# EAGLE design Nanocopter_V2 (EAGLE 6.5.0)
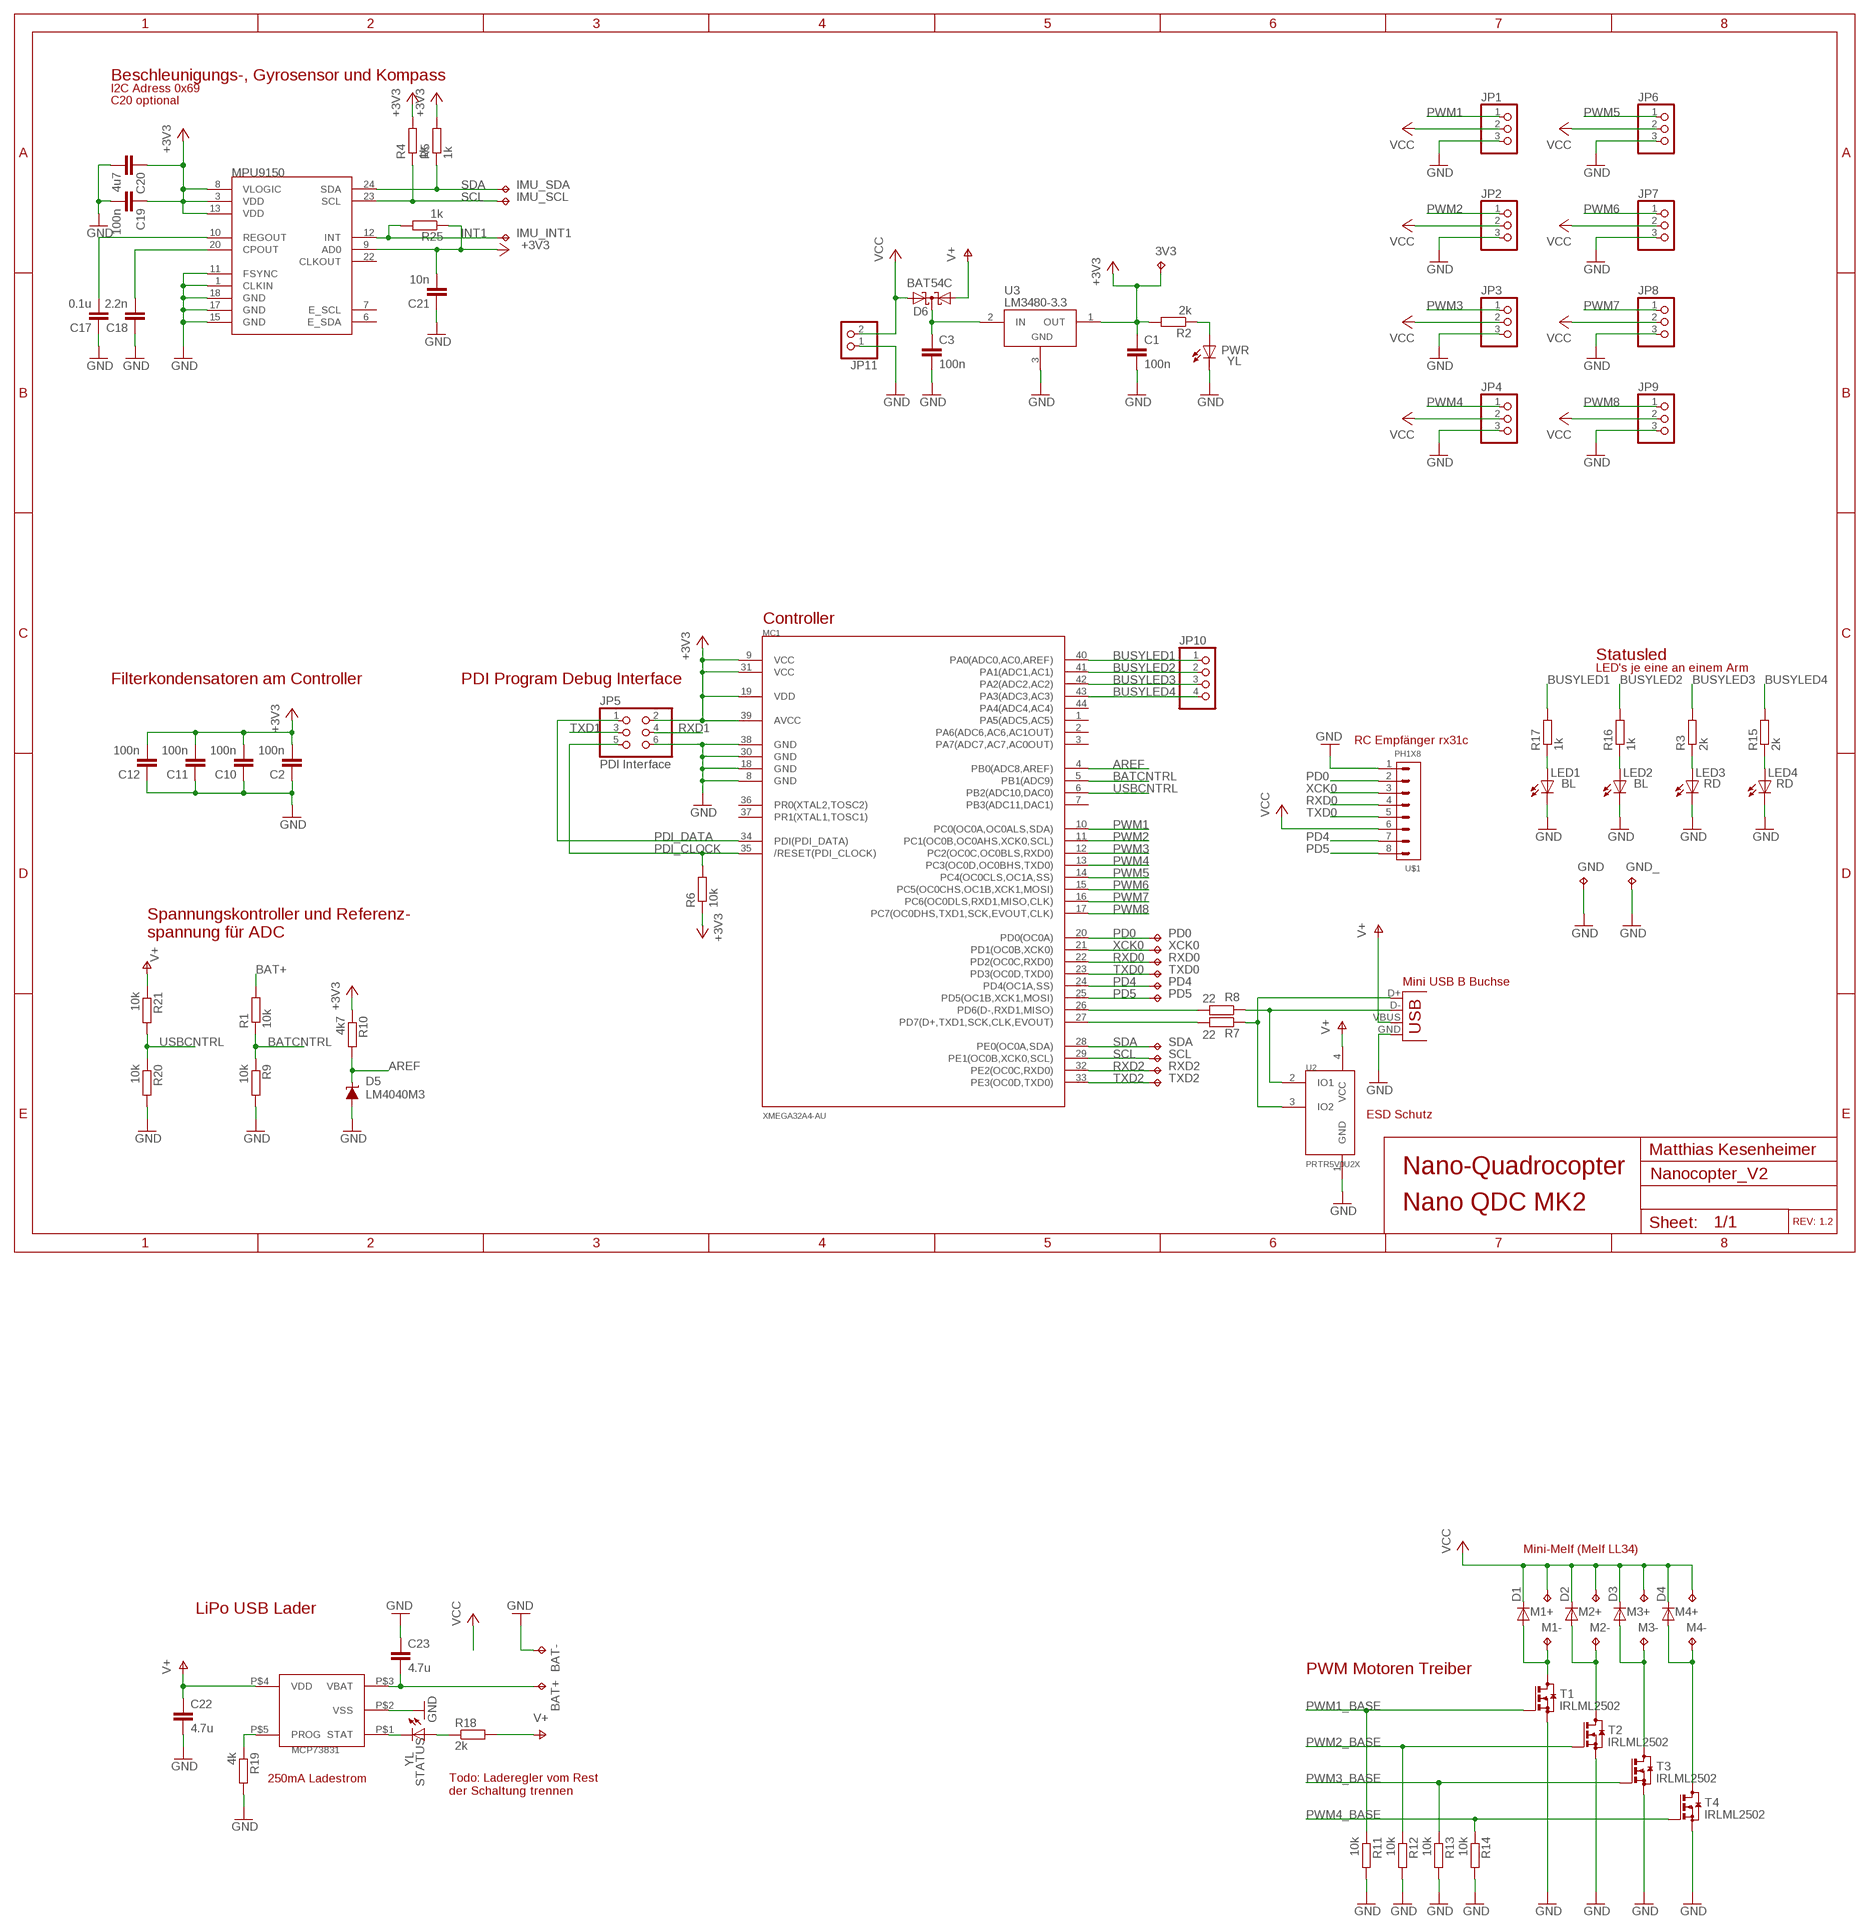
[diagram p0: schematic, sheet 1]

## Parts
3V3  TPTP12SQ  [TP12SQ]
BAT+  TPTP12SQ  [TP12SQ]
BAT-  TPTP12SQ  [TP12SQ]
C1  100n  C-EUC0603  [C0603]
C2  100n  C-EUC0603  [C0603]
C3  100n  C-EUC0603  [C0603]
C10  100n  C-EUC0603  [C0603]
C11  100n  C-EUC0603  [C0603]
C12  100n  C-EUC0603  [C0603]
C17  0.1u  C-EUC0603  [C0603]
C18  2.2n  C-EUC0603  [C0603]
C19  100n  C-EUC0603  [C0603]
C20  4u7  C-EUC0603  [C0603]
C21  10n  C-EUC0603  [C0603]
C22  4.7u  C-EUC1206  [C1206]
C23  4.7u  C-EUC1206  [C1206]
D1  DIODE-MINIMELF  [MINIMELF]
D2  DIODE-MINIMELF  [MINIMELF]
D3  DIODE-MINIMELF  [MINIMELF]
D4  DIODE-MINIMELF  [MINIMELF]
D5  LM4040M3  [SOT-23]
D6  BAT54C  [SOT23]
GND  TPTP12SQ  [TP12SQ]
GND_  TPTP12SQ  [TP12SQ]
IMU_INT1  TPTP10SQ  [TP10SQ]
IMU_SCL  TPTP10SQ  [TP10SQ]
IMU_SDA  TPTP10SQ  [TP10SQ]
JP1  PINHD-1X3  [1X03]
JP2  PINHD-1X3  [1X03]
JP3  PINHD-1X3  [1X03]
JP4  PINHD-1X3  [1X03]
JP5  PDI Interface  PINHD-2X3  [2X03]
JP6  PINHD-1X3  [1X03]
JP7  PINHD-1X3  [1X03]
JP8  PINHD-1X3  [1X03]
JP9  PINHD-1X3  [1X03]
JP10  PINHD-1X4  [1X04]
JP11  PINHD-1X2  [1X02]
LED1  BL  LEDCHIPLED_0603  [CHIPLED_0603]
LED2  BL  LEDCHIPLED_0603  [CHIPLED_0603]
LED3  RD  LEDCHIPLED_0603  [CHIPLED_0603]
LED4  RD  LEDCHIPLED_0603  [CHIPLED_0603]
M1+  TPTP15SQ  [TP15SQ]
M1-  TPTP15SQ  [TP15SQ]
M2+  TPTP15SQ  [TP15SQ]
M2-  TPTP15SQ  [TP15SQ]
M3+  TPTP15SQ  [TP15SQ]
M3-  TPTP15SQ  [TP15SQ]
M4+  TPTP15SQ  [TP15SQ]
M4-  TPTP15SQ  [TP15SQ]
MC1  XMEGA32A4-AU  [TQFP44]
MCP73831  MCP73831  [5PIN_SOT23]
MPU9150  MPU-9150QFN-24-NP  [QFN-24-NP]
PD0  TPTP10SQ  [TP10SQ]
PD4  TPTP10SQ  [TP10SQ]
PD5  TPTP10SQ  [TP10SQ]
PWR  YL  LEDCHIPLED_0603  [CHIPLED_0603]
R1  10k  R-EU_R0603  [R0603]
R2  2k  R-EU_R0603  [R0603]
R3  2k  R-EU_R0603  [R0603]
R4  1k  R-EU_R0603  [R0603]
R5  1k  R-EU_R0603  [R0603]
R6  10k  R-EU_R0603  [R0603]
R7  22  R-EU_R0603  [R0603]
R8  22  R-EU_R0603  [R0603]
R9  10k  R-EU_R0603  [R0603]
R10  4k7  R-EU_R0603  [R0603]
R11  10k  R-EU_R0603  [R0603]
R12  10k  R-EU_R0603  [R0603]
R13  10k  R-EU_R0603  [R0603]
R14  10k  R-EU_R0603  [R0603]
R15  2k  R-EU_R0603  [R0603]
R16  1k  R-EU_R0603  [R0603]
R17  1k  R-EU_R0603  [R0603]
R18  2k  R-EU_R0603  [R0603]
R19  4k  R-EU_R0603  [R0603]
R20  10k  R-EU_R0603  [R0603]
R21  10k  R-EU_R0603  [R0603]
R25  1k  R-EU_R0603  [R0603]
RXD0  TPTP10SQ  [TP10SQ]
RXD2  TPTP10SQ  [TP10SQ]
SCL  TPTP10SQ  [TP10SQ]
SDA  TPTP10SQ  [TP10SQ]
STATUS  YL  LEDCHIPLED_0603  [CHIPLED_0603]
T1  IRLML2502  BSS123  [SOT23]
T2  IRLML2502  BSS123  [SOT23]
T3  IRLML2502  BSS123  [SOT23]
T4  IRLML2502  BSS123  [SOT23]
TXD0  TPTP10SQ  [TP10SQ]
TXD2  TPTP10SQ  [TP10SQ]
U2  PRTR5V0U2X  [SOT143B]
U3  LM3480-3.3  [SOT-23-3]
U$1  PH1X8  [PHL005-1-8]
X1  USBSMD  [USB-MINIB]
XCK0  TPTP10SQ  [TP10SQ]

## Nets
+3V3: 3V3.TP C1.1 C2.2 C10.2 C11.2 C12.2 C19.1 C20.1 C21.2 JP5.2 MC1.9(VCC) MC1.19(VDD) MC1.31(VCC) MC1.39(AVCC) MPU9150.3(VDD) MPU9150.8(VLOGIC) MPU9150.9(AD0) MPU9150.13(VDD) R2.2 R4.2 R5.2 R6.1 R10.1 R25.1 U3.1(OUT)
AREF: D5.1(C) MC1.4(PB0(ADC8,AREF)) R10.2
BAT+: BAT+.TP C23.2 MCP73831.P$3(VBAT) R1.2
BATCNTRL: MC1.5(PB1(ADC9)) R1.1 R9.1
BUSYLED1: JP10.1 MC1.40(PA0(ADC0,AC0,AREF)) R17.2
BUSYLED2: JP10.2 MC1.41(PA1(ADC1,AC1)) R16.2
BUSYLED3: JP10.3 MC1.42(PA2(ADC2,AC2)) R3.2
BUSYLED4: JP10.4 MC1.43(PA3(ADC3,AC3)) R15.2
GND: BAT-.TP C1.2 C2.1 C3.2 C10.1 C11.1 C12.1 C17.1 C18.1 C19.2 C20.2 C21.1 C22.2 C23.1 D5.2(A) GND.TP GND_.TP JP1.3 JP2.3 JP3.3 JP4.3 JP5.6 JP6.3 JP7.3 JP8.3 JP9.3 JP11.1 LED1.C LED2.C LED3.C LED4.C MC1.8(GND) MC1.18(GND) MC1.30(GND) MC1.38(GND) MCP73831.P$2(VSS) MPU9150.1(CLKIN) MPU9150.11(FSYNC) MPU9150.15(GND) MPU9150.17(GND) MPU9150.18(GND) PWR.C R9.2 R11.2 R12.2 R13.2 R14.2 R19.2 R20.2 T1.2(S) T2.2(S) T3.2(S) T4.2(S) U2.1(GND) U3.3(GND) U$1.1 X1.GND
INT1: IMU_INT1.TP MPU9150.12(INT) R25.2
N$1: C18.2 MPU9150.20(CPOUT)
N$2: MCP73831.P$1(STAT) STATUS.C
N$3: R18.1 STATUS.A
N$4: MCP73831.P$5(PROG) R19.1
N$5: C17.2 MPU9150.10(REGOUT)
N$6: C3.1 D6.3(CC) U3.2(IN)
N$9: PWR.A R2.1
N$10: LED3.A R3.1
N$15: LED4.A R15.1
N$17: LED2.A R16.1
N$18: LED1.A R17.1
N$19: D1.A M1-.TP T1.3(D)
N$21: D3.A M3-.TP T3.3(D)
N$22: D4.A M4-.TP T4.3(D)
N$30: D2.A M2-.TP T2.3(D)
PD0: MC1.20(PD0(OC0A)) PD0.TP U$1.2
PD4: MC1.24(PD4(OC1A,SS)) PD4.TP U$1.7
PD5: MC1.25(PD5(OC1B,XCK1,MOSI)) PD5.TP U$1.8
PDI_CLOCK: JP5.5 MC1.35(/RESET(PDI_CLOCK)) R6.2
PDI_DATA: JP5.1 MC1.34(PDI(PDI_DATA))
PWM1: JP1.1 MC1.10(PC0(OC0A,OC0ALS,SDA))
PWM1_BASE: R11.1 T1.1(G)
PWM2: JP2.1 MC1.11(PC1(OC0B,OC0AHS,XCK0,SCL))
PWM2_BASE: R12.1 T2.1(G)
PWM3: JP3.1 MC1.12(PC2(OC0C,OC0BLS,RXD0))
PWM3_BASE: R13.1 T3.1(G)
PWM4: JP4.1 MC1.13(PC3(OC0D,OC0BHS,TXD0))
PWM4_BASE: R14.1 T4.1(G)
PWM5: JP6.1 MC1.14(PC4(OC0CLS,OC1A,SS))
PWM6: JP7.1 MC1.15(PC5(OC0CHS,OC1B,XCK1,MOSI))
PWM7: JP8.1 MC1.16(PC6(OC0DLS,RXD1,MISO,CLK))
PWM8: JP9.1 MC1.17(PC7(OC0DHS,TXD1,SCK,EVOUT,CLK))
RXD0: MC1.22(PD2(OC0C,RXD0)) RXD0.TP U$1.4
RXD1: JP5.4 MC1.26(PD6(D-,RXD1,MISO)) R8.2
RXD2: MC1.32(PE2(OC0C,RXD0)) RXD2.TP
SCL: IMU_SCL.TP MC1.29(PE1(OC0B,XCK0,SCL)) MPU9150.23(SCL) R4.1 SCL.TP
SDA: IMU_SDA.TP MC1.28(PE0(OC0A,SDA)) MPU9150.24(SDA) R5.1 SDA.TP
TXD0: MC1.23(PD3(OC0D,TXD0)) TXD0.TP U$1.5
TXD1: JP5.3 MC1.27(PD7(D+,TXD1,SCK,CLK,EVOUT)) R7.2
TXD2: MC1.33(PE3(OC0D,TXD0)) TXD2.TP
USB+: R7.1 U2.3(IO2) X1.D+
USB-: R8.1 U2.2(IO1) X1.D-
USBCNTRL: MC1.6(PB2(ADC10,DAC0)) R20.1 R21.2
V+: D6.1(A1) R18.2 R21.1 U2.4(VCC) X1.VBUS
VCC: D1.C D2.C D3.C D4.C D6.2(A2) JP1.2 JP2.2 JP3.2 JP4.2 JP6.2 JP7.2 JP8.2 JP9.2 JP11.2 M1+.TP M2+.TP M3+.TP M4+.TP U$1.6
VDD: C22.1 MCP73831.P$4(VDD) ; supply symbol labelled V+
XCK0: MC1.21(PD1(OC0B,XCK0)) U$1.3 XCK0.TP
Unconnected: MC1.1(PA5(ADC5,AC5)) MC1.2(PA6(ADC6,AC6,AC1OUT)) MC1.3(PA7(ADC7,AC7,AC0OUT)) MC1.7(PB3(ADC11,DAC1)) MC1.36(PR0(XTAL2,TOSC2)) MC1.37(PR1(XTAL1,TOSC1)) MC1.44(PA4(ADC4,AC4)) MPU9150.6(E_SDA) MPU9150.7(E_SCL) MPU9150.22(CLKOUT)

## Notes on the sheet
- Beschleunigungs-, Gyrosensor und Kompass
- I2C Adress 0x69
- C20 optional
- Controller
- Statusled
- LED's je eine an einem Arm
- Filterkondensatoren am Controller | PDI Program Debug Interface
- RC Empfänger rx31c
- Spannungskontroller und Referenz-
  spannung für ADC
- Mini USB B Buchse
- ESD Schutz
- Matthias Kesenheimer
- Nano-Quadrocopter
- Nano QDC MK2
- REV: 1.2
- Mini-Melf (Melf LL34)
- LiPo USB Lader
- PWM Motoren Treiber
- 250mA Ladestrom
- Todo: Laderegler vom Rest
  der Schaltung trennen

## Library data of the parts
3V3 BAT+ BAT- GND GND_ IMU_INT1 IMU_SCL IMU_SDA M1+ M1- M2+ M2- M3+ M3- M4+ M4- PD0 PD4 PD5 RXD0 RXD2 SCL SDA TXD0 TXD2 XCK0 = testpad:TP: Test pad
C1-C3 C10-C12 C17-C23 = rcl:C-EU: CAPACITOR, European symbol
D1-D4 = diode:DIODE-: DIODE
D5 = texas:LM4040M3
D6 = diode:BAT54C: Schottky Diodes Source: Fairchild .. BAT54.pdf
JP1-JP4 JP6-JP9 = pinhead:PINHD-1X3: PIN HEADER
JP5 = pinhead:PINHD-2X3: PIN HEADER
JP10 = pinhead:PINHD-1X4: PIN HEADER
JP11 = pinhead:PINHD-1X2: PIN HEADER
LED1-LED4 PWR STATUS = led:LED: LED OSRAM: - CHIPLED LG R971, LG N971, LY N971, LG Q971, LY Q971, LO R971, LY R971 LH N974, LH R974 LS Q976, LO Q976, LY Q976 LO Q996 - Hyper CHIPLED LW Q18S LB Q993, LB Q99A, LB R99A - SideLED LS A670, LO A670, LY A670, LG A670, LP A670 LB A673, LV A673, LT A673, LW A673 LH A674 LY A675 LS A676, LA A676, LO A676, LY A676, LW A676 LS A679, LY A679, LG A679 - Hyper Micro SIDELED® LS Y876, LA Y876, LO Y876, LY Y876 LT Y87S - SmartLED LW L88C, LW L88S LB L89C, LB L89S, LG L890 LS L89K, LO L89K, LY L89K LS L896, LA L896, LO L896, LY L896 - TOPLED LS T670, LO T670, LY T670, LG T670, LP T670 LSG T670, LSP T670, LSY T670, LOP T670, LYG T670 LG T671, LOG T671, LSG T671 LB T673, LV T673, LT T673, LW T673 LH T674 LS T676, LA T676, LO T676, LY T676, LB T676, LH T676, LSB T676, LW T676 LB T67C, LV T67C, LT T67C, LS T67K, LO T67K, LY T67K, LW E67C LS E67B, LA E67B, LO E67B, LY E67B, LB E67C, LV E67C, LT E67C LW T67C LS T679, LY T679, LG T679 LS T770, LO T770, LY T770, LG T770, LP T770 LB T773, LV T773, LT T773, LW T773 LH T774 LS E675, LA E675, LY E675, LS T675 LS T776, LA T776, LO T776, LY T776, LB T776 LHGB T686 LT T68C, LB T68C - Hyper Mini TOPLED® LB M676 - Mini TOPLED Santana® LG M470 LS M47K, LO M47K, LY M47K Source: http://www.osram.convergy.de LUXEON: - LUMILED® LXK2-PW12-R00, LXK2-PW12-S00, LXK2-PW14-U00, LXK2-PW14-V00 LXK2-PM12-R00, LXK2-PM12-S00, LXK2-PM14-U00 LXK2-PE12-Q00, LXK2-PE12-R00, LXK2-PE12-S00, LXK2-PE14-T00, LXK2-PE14-U00 LXK2-PB12-K00, LXK2-PB12-L00, LXK2-PB12-M00, LXK2-PB14-N00, LXK2-PB14-P00, LXK2-PB14-Q00 LXK2-PR12-L00, LXK2-PR12-M00, LXK2-PR14-Q00, LXK2-PR14-R00 LXK2-PD12-Q00, LXK2-PD12-R00, LXK2-PD12-S00 LXK2-PH12-R00, LXK2-PH12-S00 LXK2-PL12-P00, LXK2-PL12-Q00, LXK2-PL12-R00 Source: www.luxeon.com KINGBRIGHT: KA-3528ASYC Source: www.kingbright.com
MC1 = atmel:XMEGA32A4-AU
MCP73831 = BaseApp:MCP73831: Digikey No:- __MCP73831T-2ACI/OTCT-ND__
MPU9150 = SparkFun-Sensors:MPU-9150: 9DOF (3mag, 3accel, 3rotat). I2C interface.
R1-R21 R25 = rcl:R-EU_: RESISTOR, European symbol
T1-T4 = transistor-small-signal:BSS123: N-CHANNEL MOS FET
U2 = Philips:PRTR5V0U2X
U3 = regulators:LM3480-*: National Semiconductor LM3480 100 mA, SOT-23, quasi-LDO linear regulator
U$1 = pel_hdr:PH1X8
X1 = SparkFun:USB: USB Connectors USB-B-PTH is fully proven SKU : PRT-00139 USB-miniB is fully proven SKU : PRT-00587 USB-A-PCB is untested. USB-A-H is throughly reviewed, but untested. Spark Fun Electronics SKU : PRT-00437 USB-B-SMT is throughly reviewed, but untested. Needs silkscreen touching up. USB-A-S has not been used/tested USB-MB-H has not been used/tested

## Board
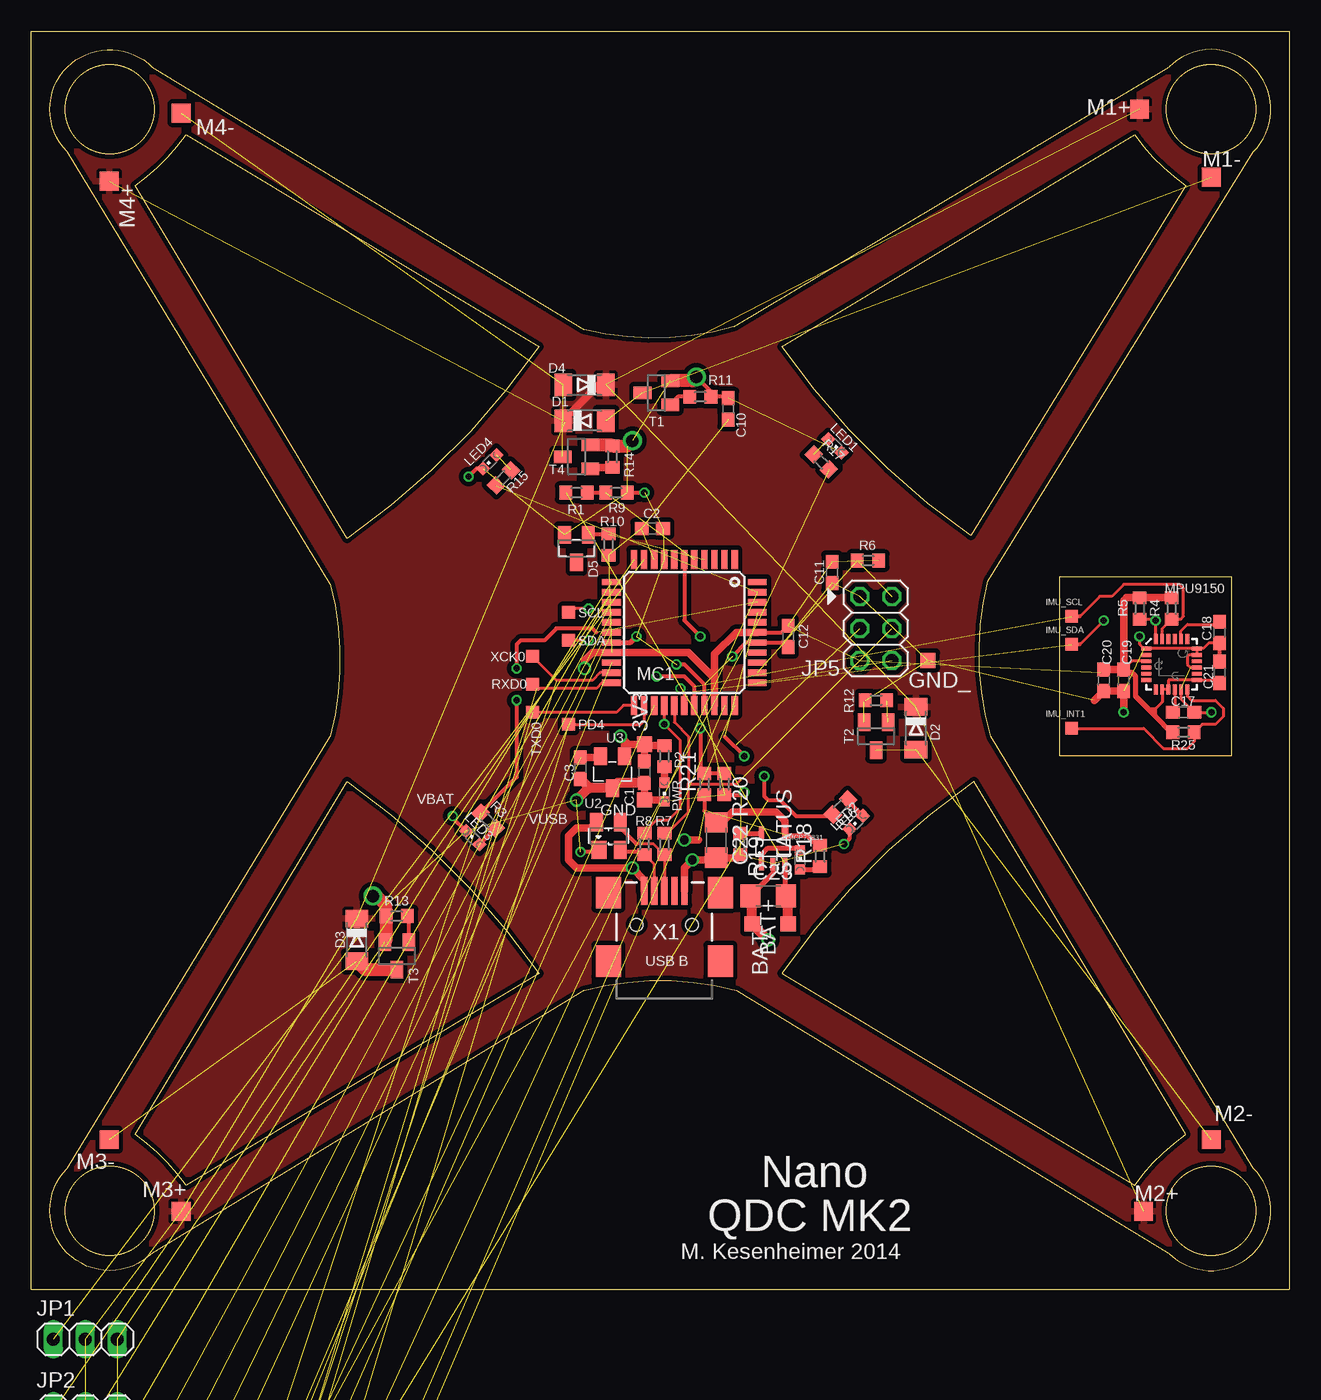
[diagram p1: board, top side]
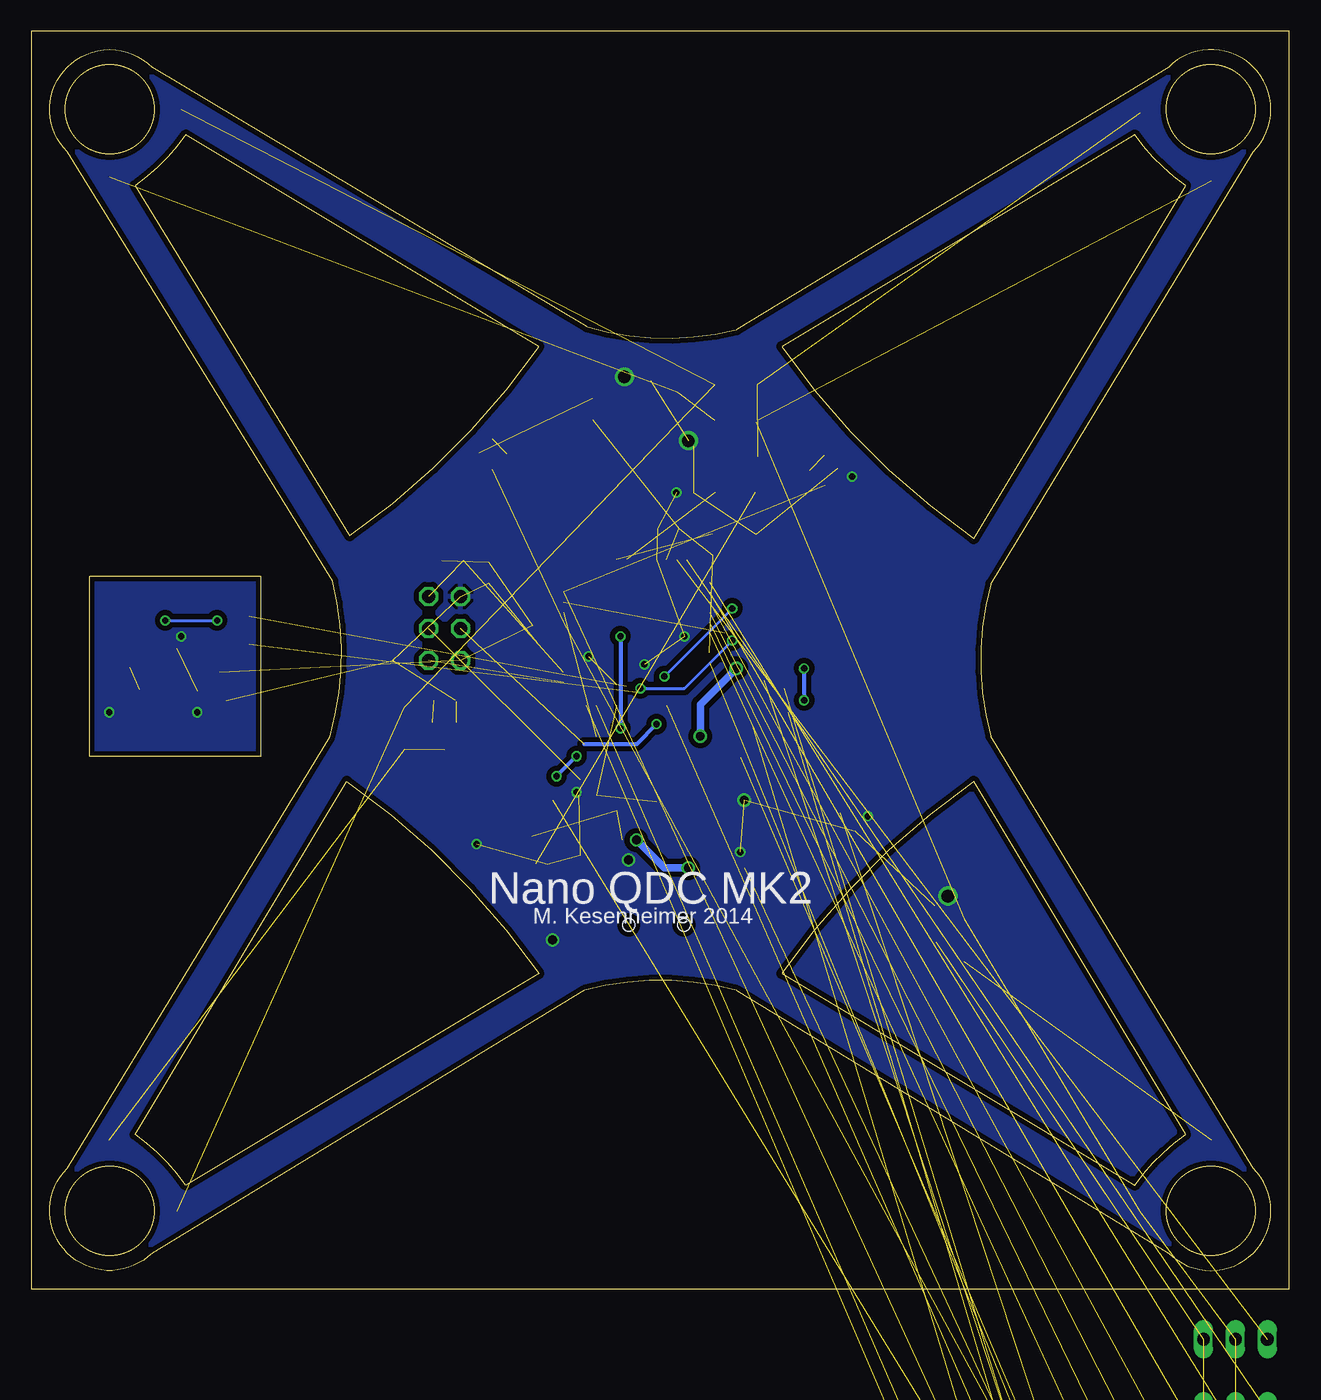
[diagram p2: board, bottom side, seen from below]

Size 100 x 100 mm. Coordinates in mm from the lower left corner, seen from the top.
Outline: 43.94,23.76 arc-30 56.07,23.76 90.41,2.88 arc90 97.15,2.88 arc90 97.15,9.61 76.27,43.96 arc-30 76.05,56.31 97.15,90.44 arc90 97.15,97.17 arc90 90.41,97.17 55.84,76.52 arc-30 43.94,76.29 9.59,97.17 arc90 2.86,97.17 arc90 2.86,90.44 23.74,56.09 arc-30 23.74,43.96 2.86,9.61 arc90 2.86,2.88 arc90 9.59,2.88 43.94,23.76
Outline: 87.72,8.27 arc-20 91.76,12.31 74.92,40.37 arc20 59.66,25.11 87.72,8.27
Outline: 74.7,59.9 arc-20 59.66,74.95 87.72,91.78 arc20 91.76,87.74 74.7,59.9
Outline: 40.35,74.95 arc-20 25.08,59.68 8.25,87.74 arc20 12.29,91.78 40.35,74.95
Outline: 25.08,40.37 arc-20 40.35,25.11 12.29,8.27 arc20 8.25,12.31 25.08,40.37
Outline: 0,0 0,100 100,100 100,0 0,0
Outline: 95.4,42.38 81.75,42.38 81.75,56.67 95.4,56.67 95.4,42.38
Outline: circle at 93.78,93.81 radius 3.55
Outline: circle at 93.78,6.25 radius 3.55
Outline: circle at 6.22,93.81 radius 3.55
Outline: circle at 6.22,6.25 radius 3.55
Copper layers (1*16): Top 0.035mm / dielectric 1.5mm / Bottom 0.035mm
Design rules "default": minimum track width 6mil, minimum drill 12mil, track to track 6mil, track to pad 6mil, pad to pad 6mil, via to via 6mil, smd to smd 0mil, copper to edge 10mil, drill to drill 10mil, minimum pad ring 10mil, minimum via ring 6mil, stop-mask expansion 2mil, vias tented up to drill 100mil, thermal gap 10mil

### Footprints (pad centres in the part's own frame; a part is rotated, then mirrored left to right if it is on the bottom)
TP12SQ = smd 1.2 x 1.2: TP 0,0
C0603 = smd 1.1 x 1: 1 -0.85,0; 2 0.85,0
C1206 = smd 1.6 x 1.8: 1 -1.4,0; 2 1.4,0
MINIMELF = smd 1.4 x 1.8: A 1.7,0; C -1.7,0
SOT-23 = smd 1 x 1.4: 1 -0.95,-1.1; 2 0.95,-1.1; 3 0,1.1
SOT23 = smd 1 x 1.4: 1 -0.95,-1.1; 2 0.95,-1.1; 3 0,1.1
TP10SQ = smd 1 x 1: TP 0,0
1X03 = drill 1.016 long: 1 -2.54,0; 2 0,0; 3 2.54,0
2X03 = drill 1.016 octagon: 1 -2.54,-1.27; 2 -2.54,1.27; 3 0,-1.27; 4 0,1.27; 5 2.54,-1.27; 6 2.54,1.27
1X04 = drill 1.016 long: 1 -3.81,0; 2 -1.27,0; 3 1.27,0; 4 3.81,0
1X02 = drill 1.016 long: 1 -1.27,0; 2 1.27,0
CHIPLED_0603 = smd 0.8 x 0.8: A 0,-0.75; C 0,0.75
TP15SQ = smd 1.5 x 1.5: TP 0,0
TQFP44 = smd 1.5 x 0.5: 1 -5.8,4; 2 -5.8,3.2; 3 -5.8,2.4; 4 -5.8,1.6; 5 -5.8,0.8; 6 -5.8,0; 7 -5.8,-0.8; 8 -5.8,-1.6; 9 -5.8,-2.4; 10 -5.8,-3.2; 11 -5.8,-4; 23 5.8,-4; 24 5.8,-3.2; 25 5.8,-2.4; 26 5.8,-1.6; 27 5.8,-0.8; 28 5.8,0; 29 5.8,0.8; 30 5.8,1.6; 31 5.8,2.4; 32 5.8,3.2; 33 5.8,4 | smd 0.5 x 1.5: 12 -4,-5.8; 13 -3.2,-5.8; 14 -2.4,-5.8; 15 -1.6,-5.8; 16 -0.8,-5.8; 17 0,-5.8; 18 0.8,-5.8; 19 1.6,-5.8; 20 2.4,-5.8; 21 3.2,-5.8; 22 4,-5.8; 34 4,5.8; 35 3.2,5.8; 36 2.4,5.8; 37 1.6,5.8; 38 0.8,5.8; 39 0,5.8; 40 -0.8,5.8; 41 -1.6,5.8; 42 -2.4,5.8; 43 -3.2,5.8; 44 -4,5.8
5PIN_SOT23 = smd 0.4 x 1: P$1 0.4,-0.63; P$2 1.35,-0.63; P$3 2.3,-0.63; P$4 2.3,1.87; P$5 0.4,1.87
QFN-24-NP = smd 0.8 x 0.3: 1 -2,1.25; 2 -2,0.75; 3 -2,0.25; 4 -2,-0.25; 5 -2,-0.75; 6 -2,-1.25; 13 2,-1.25; 14 2,-0.75; 15 2,-0.25; 16 2,0.25; 17 2,0.75; 18 2,1.25 | smd 0.3 x 0.8: 7 -1.25,-2; 8 -0.75,-2; 9 -0.25,-2; 10 0.25,-2; 11 0.75,-2; 12 1.25,-2; 19 1.25,2; 20 0.75,2; 21 0.25,2; 22 -0.25,2; 23 -0.75,2; 24 -1.25,2
R0603 = smd 1 x 1.1: 1 -0.85,0; 2 0.85,0
SOT143B = smd 1.2 x 1.44: 1 -0.75,-1.1 | smd 1 x 1.44: 2 0.95,-1.1; 3 0.95,1.1; 4 -0.95,1.1
SOT-23-3 = smd 1.016 x 1.397: 1 -0.953,-1.27; 2 0.953,-1.27; 3 0,1.27
PHL005-1-8 = drill 0.7 pad 1.016 long: 1 0,0; 2 1.27,0; 3 2.54,0; 4 3.81,0; 5 5.08,0; 6 6.35,0; 7 7.62,0; 8 8.89,0
USB-MINIB = smd 2.25 x 0.5: D+ 2.625,0; D- 2.625,0.8; GND 2.625,-1.6; ID 2.625,-0.8; VBUS 2.625,1.6 | smd 2.5 x 2: MTN1 -2.95,4.45; MTN2 2.5,4.45; MTN3 -2.95,-4.45; MTN4 2.5,-4.45 | hole 1: -0.07,2.2; -0.07,-2.2

### Placement (x,y rotation side)
3V3  48.73,43.33 0 top
BAT+  60.16,29.04 90 top
BAT-  57.3,29.04 90 top
C1  48.73,41.11 270 top
C2  49.36,60.48 180 top
C3  43.65,41.43 270 top
C10  55.4,70 270 top
C11  63.65,56.98 90 top
C12  60.16,51.9 90 top
C17  91.59,45.87 180 top
C18  94.45,52.22 90 top
C19  86.83,48.41 270 top
C20  85.24,48.41 270 top
C21  94.45,49.05 270 top
C22  54.44,35.71 270 top
C23  58.57,31.27 0 top
D1  43.97,69.05 0 top
D2  70.32,44.6 270 top
D3  25.87,27.77 270 top
D4  43.97,71.91 180 top
D5  43.33,58.89 180 top
D6  2.37,-55.41 0 top  (outside the outline)
GND  48.73,38.89 0 top
GND_  71.27,50 0 top
IMU_INT1  82.7,44.6 0 top
IMU_SCL  82.7,53.49 0 top
IMU_SDA  82.7,51.27 0 top
JP1  4.28,-3.98 0 top  (outside the outline)
JP2  4.28,-9.69 0 top  (outside the outline)
JP3  4.28,-15.41 0 top  (outside the outline)
JP4  4.28,-21.12 0 top  (outside the outline)
JP5  67.14,52.54 90 top
JP6  4.28,-26.84 0 top  (outside the outline)
JP7  4.28,-32.55 0 top  (outside the outline)
JP8  4.28,-38.27 0 top  (outside the outline)
JP9  4.28,-43.98 0 top  (outside the outline)
JP10  5.55,-49.7 0 top  (outside the outline)
JP11  3.01,-74.14 0 top  (outside the outline)
LED1  63.88,67.05 225 top
LED2  65.56,37.11 135 top
LED3  35.08,35.9 45 top
LED4  36.44,65.78 135 top
M1+  88.1,93.81 0 top
M1-  93.81,88.42 0 top
M2+  88.42,6.18 0 top
M2-  93.81,11.9 0 top
M3+  11.9,6.18 0 top
M3-  6.18,11.9 0 top
M4+  6.18,88.1 0 top
M4-  11.9,93.5 0 top
MC1  51.9,52.22 270 top
MCP73831  57.62,34.44 0 top
MPU9150  90.64,49.68 0 top
PD0  0.79,-61.44 0 top  (outside the outline)
PD4  42.7,44.92 0 top
PD5  0.79,-64.94 0 top  (outside the outline)
PWR  50.32,39.52 180 top
R1  43.33,63.33 180 top
R2  50.32,42.38 90 top
R3  36.31,37.26 135 top
R4  90.64,54.13 90 top
R5  88.1,54.13 90 top
R6  66.51,57.94 180 top
R7  50.32,35.39 90 top
R8  48.73,35.39 90 top
R9  46.51,63.33 0 top
R10  45.87,59.21 90 top
R11  53.17,70.95 0 top
R12  67.14,46.82 180 top
R13  29.04,29.68 180 top
R14  46.19,66.19 90 top
R15  37.52,64.51 225 top
R16  64.33,38.35 225 top
R17  62.79,65.78 315 top
R18  62.7,34.44 90 top
R19  56.35,35.39 270 top
R20  55.08,40.16 270 top
R21  53.49,40.16 90 top
R25  91.59,44.28 0 top
RXD0  39.84,48.09 0 top
RXD2  0.79,-78.59 0 top  (outside the outline)
SCL  42.7,53.81 0 top
SDA  42.7,51.59 0 top
STATUS  61.11,34.12 0 top
T1  49.68,71.27 90 top
T2  67.14,43.97 180 top
T3  29.04,26.5 180 top
T4  43.33,66.19 90 top
TXD0  39.84,45.87 0 top
TXD2  0.79,-82.08 0 top  (outside the outline)
U2  45.87,36.03 0 top
U3  46.19,41.11 180 top
U$1  0.79,-68.43 0 top  (outside the outline)
X1  50.32,29.04 90 top
XCK0  39.84,50.32 0 top

### Tracks (layer width: path | path; a pad name or v marks a point on that pad's centre or on a via)
+3V3  (via drill 0.7)  (8 unrouted)
  Top 0.254: 94.21,48.43 MPU9150.13 90.39,48.43 MPU9150.9 MPU9150.8 89.89,46.71 89.37,46.19 | MPU9150.3 87.5,49.93 C19.1 | 89.37,46.19 89.05,45.87 | 89.37,45.55 89.37,46.19 | 88.73,46.19 89.37,46.19
  Top 0.305: 94.21,48.43 C21.2 | MC1.39 59.63,52.22 C12.2
  Top 0.406: R25.1 90.64,44.28 89.37,45.55 89.05,45.87 88.73,46.19 87.78,47.14 87.78,48.73 87.46,49.05 87.04,49.05 C19.1
  Top 0.61: R2.2 48.83,43.23 3V3.TP | 3V3.TP C1.1 | R4.2 R5.2 87.04,54.98 86.83,54.76 C19.1 C20.1 85.03,49.05 | U3.1 47.14,43.65 v46.82,43.97 47.46,43.33 3V3.TP | MC1.31 54.3,48.55 | 54.3,48.55 52.22,50.63 46.12,50.63 MC1.19 44.59,50.62 43.97,50 v43.97,49.36 | 54.3,48.55 54.3,50.49 56.03,52.22 MC1.39
  Bottom 0.61: v46.82,43.97 46.82,46.51 v43.97,49.36
AREF  (1 unrouted)
  Top 0.305: R10.2 44.35,60.06 D5.1
BAT+  (1 unrouted)
  Top 0.406: MCP73831.P$3 59.92,31.32 C23.2
  Top 0.813: BAT+.TP 60.16,31.08 C23.2
BATCNTRL  (1 unrouted)
  Top 0.305: R1.1 R9.1
BUSYLED1  (2 unrouted)
BUSYLED2  (via drill 0.5)  (2 unrouted)
  Top 0.305: 55.1,43.94 v56.67,42.38 | v58.25,40.79 58.25,39.2 58.57,38.89 59.52,38.89 60.79,37.62 63.6,37.62 R16.2
  Bottom 0.305: v56.67,42.38 v58.25,40.79
BUSYLED3  (via drill 0.5)  (2 unrouted)
  Top 0.305: 44.92,52.22 44.6,52.54 41.74,52.54 40.79,51.59 38.89,51.59 38.57,51.27 v38.57,49.36 | v38.57,46.82 38.57,40.72 R3.2
  Bottom 0.305: v38.57,49.36 v38.57,46.82
BUSYLED4  (2 unrouted)
GND  (via drill 0.5, 0.7, 1)  (36 unrouted)
  Top 0.254: C18.1 93.6,51.37 93.18,50.95 92.66,50.95 | v93.81,45.87 C17.1 91.39,46.92 MPU9150.11 | v88.1,51.9 88.1,51.27 88.44,50.93 MPU9150.1 MPU9150.18 MPU9150.17 92.02,50.43 91.91,50.32 91.91,49.68 92.16,49.43 MPU9150.15
  Top 0.305: C10.1 55.29,70.95 R11.2 54.02,71.37 v52.86,72.54 | R12.2 66.19,46.72 | R9.2 v48.73,63.33 | LED3.C 33.49,37.49 v33.49,37.62 | LED4.C 35.41,65.25 v34.76,64.6 | U2.1 44.95,34.76 v43.65,34.76 | C18.1 C21.1 | 92.66,50.95 MPU9150.18 | R20.2 56.45,39.31 v56.67,39.52 | MC1.30 53.5,48.08 51.9,49.68 v51.27,49.68 | C12.1 59.79,51.42 MC1.38 56.82,51.42 v55.71,50.32 | LED2.C 65.03,35.82 v64.6,35.39
  Top 0.406: MCP73831.P$2 58.97,33.06 C23.1 | MC1.18 47.61,51.42 v48.09,51.9
  Top 0.61: 46.09,67.14 R14.2 | C1.2 GND.TP 50.2,38.89 PWR.C | 46.61,40.26 U3.3 | 28.19,27.7 T3.2 | X1.GND 51.92,33.5 v52.54,34.12 54.26,34.12 C22.2 56.12,34.31 R19.2 | v86.83,45.87 C19.2 C20.2 84.5,46.82
  Top 0.813: C1.2 46.61,40.26 | U3.3 44.39,39.84 | 44.39,39.84 C3.2 | 43.55,40.47 C3.2 | 43.52,40.45 C3.2 | C23.1 57.3,31.14 BAT-.TP v58.57,27.77 | 44.39,39.84 44.28,39.84 v43.33,38.89
  Top 1.016: T1.2 52.54,72.22 v52.86,72.54 | R14.2 47.36,67.04 v47.78,67.46 | T4.2 46.09,67.14 | 28.19,27.7 R13.2 28.19,30.53 27.46,31.27 v27.14,31.27
  pour Bottom (isolate 0.406): 100,0 0,0 0,100 100,100
INT1
  Top 0.254: MPU9150.12 91.89,47.16 92.23,46.82 94.13,46.82 94.77,46.19 94.77,45.55 94.13,44.92 93.08,44.92 R25.2 92.44,43.55 91.91,43.01 90,43.01 88.42,44.6 IMU_INT1.TP
N$1
  Top 0.254: MPU9150.20 91.39,52.34 91.91,52.86 94.23,52.86
  Top 0.305: 94.23,52.86 C18.2
N$2
  Top 0.406: MCP73831.P$1 58.02,34.52 58.57,35.08 60.91,35.08 STATUS.C
N$3
  Top 0.406: STATUS.A 62.48,33.37 R18.1
N$4
  Top 0.406: R19.1 57.95,36.24 MCP73831.P$5
N$5
  Top 0.254: MPU9150.10 90.89,46.02
  Top 0.305: 90.89,46.02 C17.2
N$6  (1 unrouted)
  Top 0.61: C3.1 45.13,42.28 U3.2
N$9
  Top 0.61: PWR.A R2.1
N$10
  Top 0.305: LED3.A R3.1
N$15  (1 unrouted)
N$17
  Top 0.305: R16.1 64.93,38.8 LED2.A
N$18  (1 unrouted)
N$19  (2 unrouted)
N$21  (1 unrouted)
  Top 1.016: T3.3 26.54,25.4 D3.A
N$22  (2 unrouted)
N$30  (2 unrouted)
PD0  (2 unrouted)
PD4  (1 unrouted)
  Top 0.254: PD4.TP 48.41,44.92 48.73,45.24 48.73,46.4 MC1.24
PD5  (2 unrouted)
PDI_CLOCK  (2 unrouted)
PDI_DATA  (1 unrouted)
PWM1  (1 unrouted)
PWM1_BASE
  Top 0.305: 52.54,70.95 R11.1 51.41,70.95 T1.1
PWM2  (1 unrouted)
PWM2_BASE  (1 unrouted)
PWM3  (1 unrouted)
PWM3_BASE
  Top 0.305: T3.1 29.99,29.58 R13.1
PWM4  (1 unrouted)
PWM4_BASE
  Top 0.61: R14.1 44.53,65.34 T4.1
PWM5  (1 unrouted)
PWM6  (1 unrouted)
PWM7  (1 unrouted)
PWM8  (1 unrouted)
RXD0  (1 unrouted)
  Top 0.254: MC1.22 45.36,48.22 44.92,47.78 40.16,47.78 RXD0.TP
RXD1  (via drill 0.5)  (1 unrouted)
  Top 0.254: 48.73,36.03 R8.2 48.73,36.35 49.68,37.3 50.63,37.3 51.59,38.25 51.59,43.65 v50.3,44.93 MC1.26
  Bottom 0.305: v50.3,44.93 51.9,43.33 56.03,43.33
RXD2  (1 unrouted)
SCL  (via drill 0.5)  (1 unrouted)
  Top 0.254: MPU9150.23 89.89,52.53 R4.1 91.38,53.28 91.59,53.49 91.59,55.71 91.27,56.03 86.83,56.03 85.88,55.08 84.92,55.08 83.34,53.49 | v44.28,54.13 43.01,54.13 SCL.TP
  Top 0.305: 83.34,53.49 IMU_SCL.TP | MC1.29 52.7,47.93 51.9,48.73 v49.68,48.73
  Bottom 0.254: v49.68,48.73 v44.28,54.13
SDA  (via drill 0.5)  (1 unrouted)
  Top 0.254: R5.1 89.37,53.28 v89.37,53.17 89.37,51.68 MPU9150.24 | 83.34,51.27 v85.24,53.17 | MC1.28 51.9,47.46 v51.59,47.78 | v44.28,51.59 SDA.TP
  Top 0.305: 83.34,51.27 IMU_SDA.TP
  Bottom 0.254: v89.37,53.17 v85.24,53.17 | v51.59,47.78 48.09,47.78 v44.28,51.59
TXD0  (1 unrouted)
  Top 0.254: MC1.23 47.06,46.42 46.51,45.87 TXD0.TP
TXD1  (1 unrouted)
  Top 0.254: R7.2 50.53,36.24 52.22,37.93 52.22,40.16 | MC1.27 51.1,45.08 52.22,43.97 52.22,40.16 | 52.22,40.16 56.03,40.16 56.35,40.47
TXD2  (1 unrouted)
USB+
  Top 0.254: X1.D+ R7.1 49.47,35.39 48.09,35.39
  Top 0.305: 48.09,35.39 46.82,36.67 U2.3
USB-
  Top 0.254: X1.D- 49.52,33.76 R8.1 48.66,34.61
  Top 0.305: 48.66,34.61 48.51,34.76 46.82,34.76 46.82,35.08 46.82,35.07 U2.2
USBCNTRL  (via drill 0.5)
  Top 0.305: R20.1 R21.2 53.17,41.32 v53.17,44.6 | MC1.6 51.9,53.17 v53.17,51.9
  Bottom 0.305: v53.17,51.9 v53.17,44.6
V+  (via drill 0.7)  (3 unrouted)
  Top 0.305: R21.1 53.49,38.06
  Top 0.406: R18.2 62.48,35.29 61.75,36.03 60.2,36.03
  Top 0.61: X1.VBUS 48.72,32.55 v47.78,33.49 43.33,33.49 42.7,34.12 42.7,36.03 43.33,36.66 44.46,36.66 U2.4 | v51.9,35.71 53.04,35.71
  Bottom 0.61: v47.78,33.49 49.68,33.49 v51.9,35.71
VCC  (17 unrouted)
  Top 0.305: D1.C 42.38,68.94
  Top 0.61: D4.C 45.12,71.91 D1.C
  pour Top (isolate 0.356): 0,0 100,0 100,100 0,100
VDD
  Top 0.61: C22.1 54.89,37.11 55.71,37.93 59.21,37.93 59.92,37.22 MCP73831.P$4
XCK0  (1 unrouted)
  Top 0.254: MC1.21 45.21,49.02 44.6,48.41 41.74,48.41 XCK0.TP

### Text on the board
tPlace: VBAT | VUSB | USB B | Nano | QDC MK2 | M. Kesenheimer 2014
bPlace: Nano QDC MK2 | M. Kesenheimer 2014
Document: EAZY EZBL-3A BL ESC | EAZY EZBL-3A BL ESC